# Altium schematic sheet Sheet_1_2022-06-12.schdoc
size 57 x 37 mm
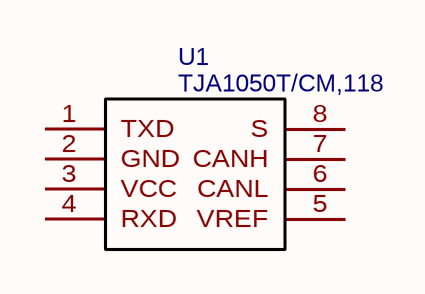
[diagram p0: Sheet_1_2022-06-12.schdoc]

## Parts
U1  TJA1050T/CM,118  [SOIC-8_L5.0-W4.0-P1.27-LS6.0-BL]

## Nets

Not connected (* = marked no-connect by the designer): U1 1(TXD) 2(GND) 3(VCC) 4(RXD) 5(VREF) 6(CANL) 7(CANH) 8(S)

## Library data of the parts
U1 = TJA1050T/CM,118: BOM_Manufacturer: NXP; BOM_Supplier: LCSC; BOM_Manufacturer Part: TJA1050T/CM,118; BOM_Supplier Part: C6952; BOM_JLCPCB Part Class: Basic Part; spicePre: U; spiceSymbolName: TJA1050T/CM,118